# Altium schematic sheet lv_io_accel.SchDoc: nav_io.schdoc
size A4; Organization: Badgerloop; Address1: 133 Engineering Research; Address2: Building; Address3: Madison, WI 53715; DocumentNumber: 1; Revision: A; SheetNumber: 1; SheetTotal: 2
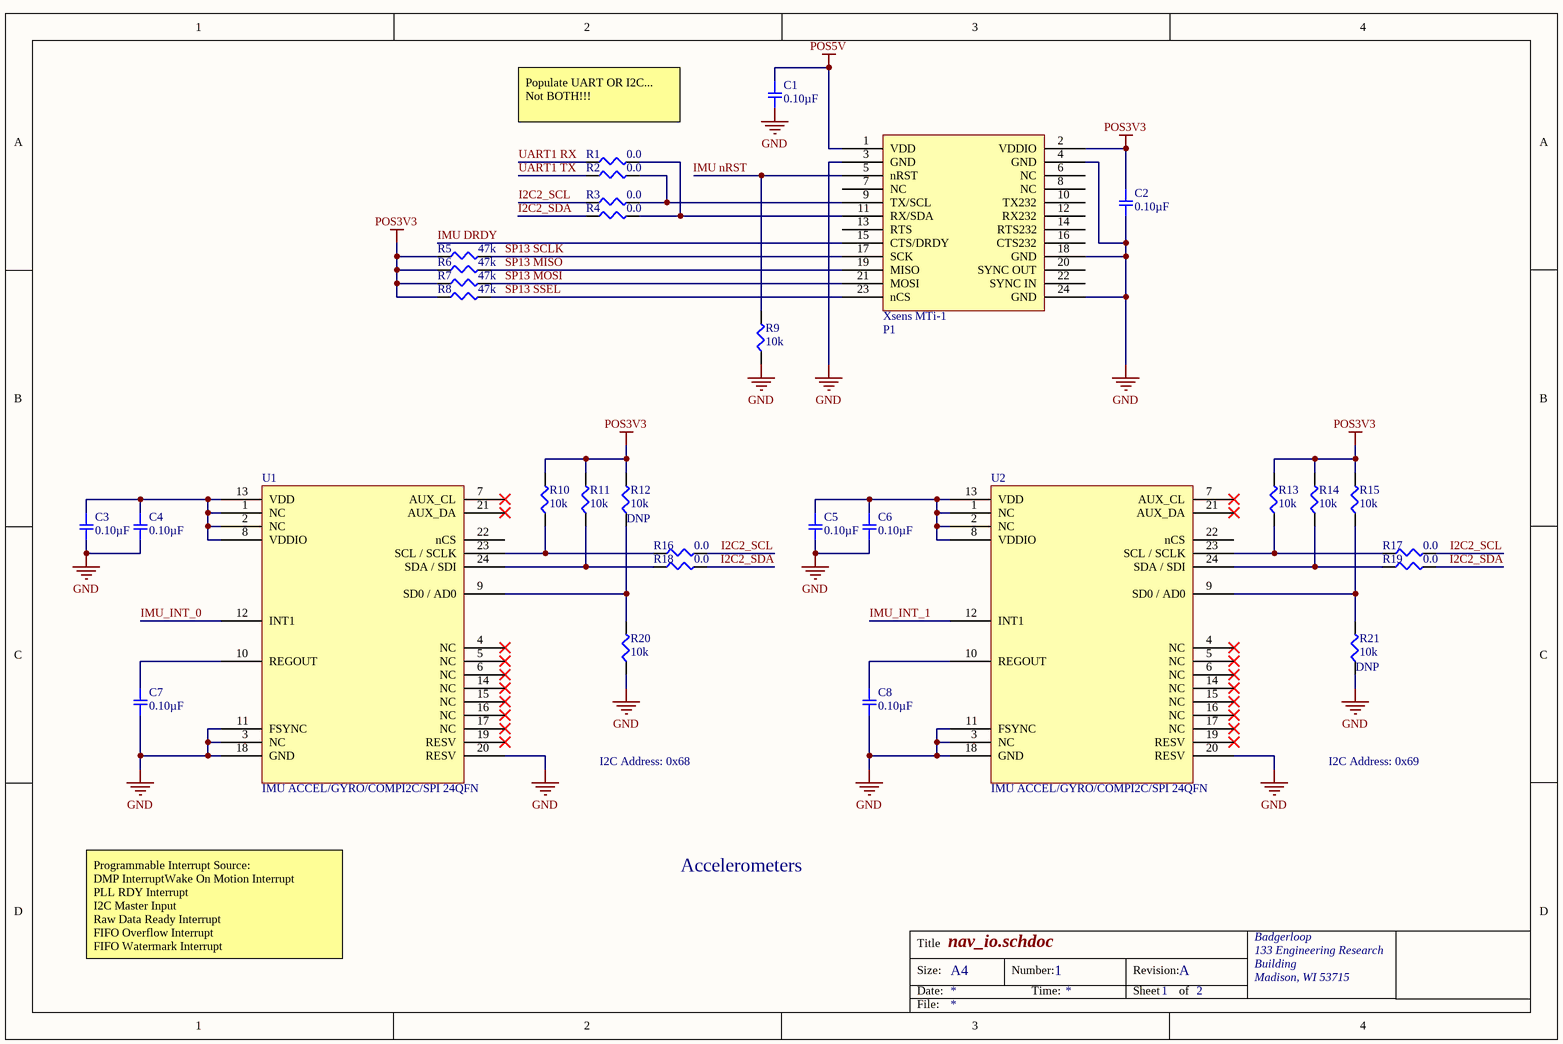
[diagram p0: lv_io_accel.SchDoc]

## Parts
C1  0.10µF  [SMD-0603C]
C2  0.10µF  [SMD-0603C]
C3  0.10µF  [SMD-0603C]
C4  0.10µF  [SMD-0603C]
C5  0.10µF  [SMD-0603C]
C6  0.10µF  [SMD-0603C]
C7  0.10µF  [SMD-0603C]
C8  0.10µF  [SMD-0603C]
P1  XSNS MTI-1  [MTI-3]  (value not drawn)
R1  0.0  [SMD-0402-RES]
R2  0.0  [SMD-0402-RES]
R3  0.0  [SMD-0402-RES]
R4  0.0  [SMD-0402-RES]
R5  47k  [SMD-0402-RES]
R6  47k  [SMD-0402-RES]
R7  47k  [SMD-0402-RES]
R8  47k  [SMD-0402-RES]
R9  10k  [SMD-0402-RES]
R10  10k  [SMD-0402-RES]
R11  10k  [SMD-0402-RES]
R12  10k  [SMD-0402-RES]
R13  10k  [SMD-0402-RES]
R14  10k  [SMD-0402-RES]
R15  10k  [SMD-0402-RES]
R16  0.0  [SMD-0402-RES]
R17  0.0  [SMD-0402-RES]
R18  0.0  [SMD-0402-RES]
R19  0.0  [SMD-0402-RES]
R20  10k  [SMD-0402-RES]
R21  10k  [SMD-0402-RES]
U1  IMU ACCEL/GYRO/COMPI2C/SPI 24QFN  [QFN40P300X300X105_HS-25N]
U2  IMU ACCEL/GYRO/COMPI2C/SPI 24QFN  [QFN40P300X300X105_HS-25N]

## Nets
GND: C1.2 C2.2 C3.2 C4.2 C5.2 C6.2 C7.2 C8.2 P1.3(GND) P1.4(GND) P1.18(GND) P1.24(GND) R9.1 R20.1 R21.1 U1.3(NC) U1.11(FSYNC) U1.18(GND) U1.20(RESV) U2.3(NC) U2.11(FSYNC) U2.18(GND) U2.20(RESV)
POS3V3: C2.1 P1.2(VDDIO) R5.1 R6.1 R7.1 R8.1 R10.2 R11.2 R12.2 R13.2 R14.2 R15.2
POS5V: C1.1 P1.1(VDD)
I2C2_SCL: R3.1 R16.2 R17.2
I2C2_SDA: R4.1 R18.2 R19.2
IMU DRDY: P1.15(CTS/DRDY)
IMU_INT_0: U1.12(INT1)
IMU_INT_1: U2.12(INT1)
SP13 MISO: P1.19(MISO) R6.2
SP13 MOSI: P1.21(MOSI) R7.2
SP13 SCLK: P1.17(SCK) R5.2
SP13 SSEL: P1.23(nCS) R8.2
UART1 RX: R1.1
UART1 TX: R2.1
NetC3_1: C3.1 C4.1 U1.1(NC) U1.2(NC) U1.8(VDDIO) U1.13(VDD)
NetC5_1: C5.1 C6.1 U2.1(NC) U2.2(NC) U2.8(VDDIO) U2.13(VDD)
NetC7_1: C7.1 U1.10(REGOUT)
NetC8_1: C8.1 U2.10(REGOUT)
NetP1_5: P1.5(nRST) R9.2
NetP1_9: P1.9(TX/SCL) R2.2 R3.2
NetP1_11: P1.11(RX/SDA) R1.2 R4.2
NetR10_1: R10.1 R16.1 U1.23(SCL_/_SCLK)
NetR11_1: R11.1 R18.1 U1.24(SDA_/_SDI)
NetR12_1: R12.1 R20.2 U1.9(SD0_/_AD0)
NetR13_1: R13.1 R17.1 U2.23(SCL_/_SCLK)
NetR14_1: R14.1 R19.1 U2.24(SDA_/_SDI)
NetR15_1: R15.1 R21.2 U2.9(SD0_/_AD0)

Not connected (* = marked no-connect by the designer): P1 6(NC) 7(NC) 8(NC) 10(TX232) 12(RX232) 13(RTS) 14(RTS232) 16(CTS232) 20(SYNC_OUT) 22(SYNC_IN); U1 4(NC)* 5(NC)* 6(NC)* 7(AUX_CL)* 14(NC)* 15(NC)* 16(NC)* 17(NC)* 19(RESV)* 21(AUX_DA)* 22(nCS); U2 4(NC)* 5(NC)* 6(NC)* 7(AUX_CL)* 14(NC)* 15(NC)* 16(NC)* 17(NC)* 19(RESV)* 21(AUX_DA)* 22(nCS)

## Notes on the sheet
- Populate UART OR I2C...
  Not BOTH!!!
- I2C Address: 0x68
- I2C Address: 0x69
- Accelerometers
- Programmable Interrupt Source:
  DMP InterruptWake On Motion Interrupt
  PLL RDY Interrupt
  I2C Master Input
  Raw Data Ready Interrupt
  FIFO Overflow Interrupt
  FIFO Watermark Interrupt
- Labels drawn without touching a wire or pin: IMU nRST
- Title
- Size:
- Date:
- A4
- Number:
- Time:
- Revision:
- Sheet
- of
- File:
- (in symbol XSNS MTI-1) Xsens MTi-1

## Library data of the parts
C1-C8 = GRM188R72A104KA35J: CAP CER 0.1UF 100V X7R 0603; Manufacturer: Murata Electronics North America; Factory Stock: 0; Unit Price (USD): 0.28; Minimum Quantity: 1; Tolerance: ±10%; Datasheets: http://www.murata.com/~/media/webrenewal/support/library/catalog/products/capacitor/mlcc/c02e.pdf; Image: //media.digikey.com/Renders/Murata%20Renders/ZRB-SERIES-0402.jpg; Digi-Key Part Number: 490-6439-1-ND; Part Number: GRM188R72A104KA35J; Quantity Available: 19148; @ qty: 0; Packaging: Cut Tape (CT); Series: GRM; Part Status: Active; Value: 0.10µF; Voltage: 100V; Temperature Coefficient: X7R; Operating Temperature: -55°C ~ 125°C; Features: -; Ratings: -; Applications: General Purpose; Mounting Type: Surface Mount, MLCC; Package / Case: 0603 (1608 Metric); Size / Dimension: 0.063" L x 0.031" W (1.60mm x 0.80mm); Height - Seated (Max): -; Thickness (Max): 0.035" (0.90mm); Lead Spacing: -; Lead Style: -
P1 = XSNS MTI-1: Manufacturer: Xsens; Manufacturer P/N: MTI-3-DK; Digikey Link: https://www.mouser.com/ProductDetail/Xsens/MTI-3-DK?qs=55YtniHzbhBGvlIRYNoxgQ%3d%3d; Digikey P/N: 512-MTI-3-DK
R1-R4 R16-R19 = ERJ-2GE0R00X: RES SMD 0.0OHM JUMPER 1/10W 0402; Manufacturer: Panasonic Electronic Components; Factory Stock: 0; Unit Price (USD): 0.00384; @ qty: 1500; Minimum Quantity: 1; Power (Watts): 0.1W, 1/10W; Part Number: ERJ-2GE0R00X; Datasheets: http://industrial.panasonic.com/www-cgi/jvcr13pz.cgi?E+PZ+3+AOA0001+ERJ2GE0R00X+7+WW; Image: //media.digikey.com/Photos/Panasonic%20Photos/ERJ-PA2-Series.jpg; Digi-Key Part Number: P0.0JCT-ND; Quantity Available: 3152483; Packaging: Cut Tape (CT); Series: ERJ; Part Status: Active; Value: 0.0; Tolerance: Jumper; Composition: Thick Film; Features: Automotive AEC-Q200; Temperature Coefficient: -; Operating Temperature: -55°C ~ 155°C; Package / Case: 0402 (1005 Metric); Supplier Device Package: 0402; Size / Dimension: 0.039" L x 0.020" W (1.00mm x 0.50mm); Height - Seated (Max): 0.016" (0.40mm); Number of Terminations: 2; Failure Rate: -
R5-R8 = ERJ-2GEJ473X: RES SMD 47K OHM 5% 1/10W 0402; Manufacturer: Panasonic Electronic Components; Factory Stock: 0; Unit Price (USD): 0.00350; @ qty: 1500; Minimum Quantity: 1; Power (Watts): 0.1W, 1/10W; Temperature Coefficient: ±200ppm/°C; Part Number: ERJ-2GEJ473X; Datasheets: http://industrial.panasonic.com/www-cgi/jvcr13pz.cgi?E+PZ+3+AOA0001+ERJ2GEJ473X+7+WW; Image: //media.digikey.com/Photos/Panasonic%20Photos/ERJ-PA2-Series.jpg; Digi-Key Part Number: P47KJCT-ND; Quantity Available: 5182645; Packaging: Cut Tape (CT); Series: ERJ; Part Status: Active; Value: 47k; Tolerance: ±5%; Composition: Thick Film; Features: Automotive AEC-Q200; Operating Temperature: -55°C ~ 155°C; Package / Case: 0402 (1005 Metric); Supplier Device Package: 0402; Size / Dimension: 0.039" L x 0.020" W (1.00mm x 0.50mm); Height - Seated (Max): 0.016" (0.40mm); Number of Terminations: 2; Failure Rate: -
R9-R15 R20 R21 = ERJ-PA2F1002X: RES SMD 10K OHM 1% 1/5W 0402; Manufacturer: Panasonic Electronic Components; Factory Stock: 0; Unit Price (USD): 0.03029; @ qty: 1500; Minimum Quantity: 1; Power (Watts): 0.2W, 1/5W; Temperature Coefficient: ±100ppm/°C; Part Number: ERJ-PA2F1002X; Datasheets: https://industrial.panasonic.com/cdbs/www-data/pdf/RDA0000/AOA0000C243.pdf; Image: //media.digikey.com/Photos/Panasonic%20Photos/ERJ-PA2-Series.jpg; Digi-Key Part Number: P17230CT-ND; Quantity Available: 12292; Packaging: Cut Tape (CT); Series: ERJ; Part Status: Active; Value: 10k; Tolerance: ±1%; Composition: Thick Film; Features: Automotive AEC-Q200, Pulse Withstanding; Operating Temperature: -55°C ~ 155°C; Package / Case: 0402 (1005 Metric); Supplier Device Package: 0402; Size / Dimension: 0.039" L x 0.020" W (1.00mm x 0.50mm); Height - Seated (Max): 0.016" (0.40mm); Number of Terminations: 2; Failure Rate: -
  R12 R21: DNP: DNP
U1 U2 = ICM-20948: Manufacturer: TDK InvenSense; Digikey Link: https://www.digikey.com/product-detail/en/tdk-invensense/ICM-20948/1428-1123-1-ND/7062698; Digikey P/N: 1428-1123-1-ND; Manufacturer P/N: ICM-20948